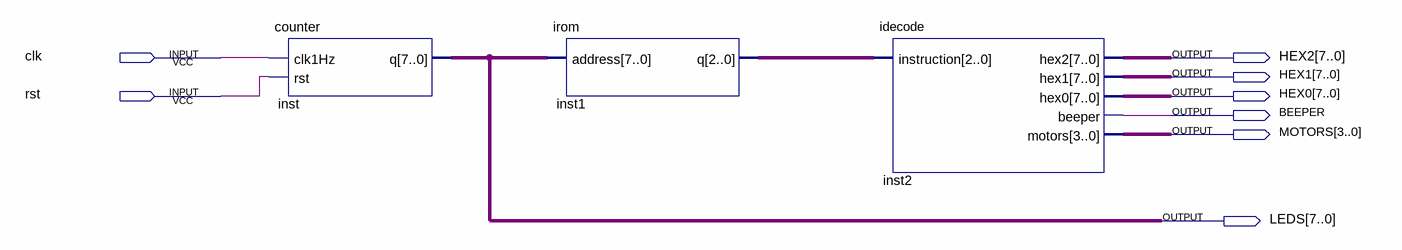
[diagram p0: schematic sheet]
// Quartus schematic lab6.bdf as structural Verilog: 3 symbols, 8 pins
module lab6 (
  input  clk,
  input  rst,
  output [7:0] HEX2,
  output [7:0] HEX1,
  output [7:0] HEX0,
  output BEEPER,
  output [3:0] MOTORS,
  output [7:0] LEDS
);

  wire [2:0] inst1_q;

  counter inst (.clk1Hz(clk), .rst(rst), .q(LEDS));
  irom inst1 (.address(LEDS), .q(inst1_q));
  idecode inst2 (.instruction(inst1_q), .hex2(HEX2), .hex1(HEX1), .hex0(HEX0), .beeper(BEEPER), .motors(MOTORS));
endmodule
